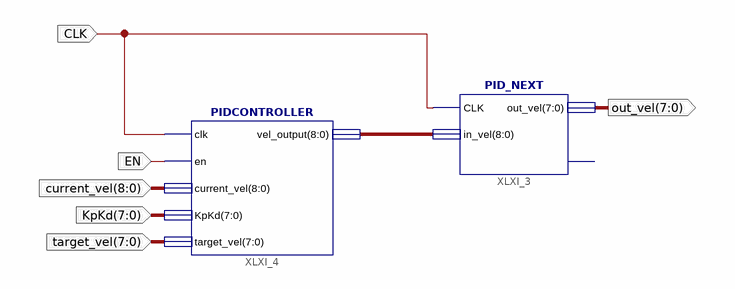
[diagram p0: schematic sheet 1]
// Xilinx ISE schematic sub_part.sch (spartan6) as structural Verilog: 2 symbols, 6 ports
module sub_part (
  input  CLK,
  input  EN,
  input  [8:0] current_vel,
  input  [7:0] KpKd,
  input  [7:0] target_vel,
  output [7:0] out_vel
);

  wire [8:0] XLXN_2;

  PID_NEXT XLXI_3 (.CLK(CLK), .in_vel(XLXN_2), .out_vel(out_vel));  // open: ovf
  PIDCONTROLLER XLXI_4 (
    .clk(CLK), .en(EN), .target_vel(target_vel), .current_vel(current_vel), .KpKd(KpKd), .vel_output(XLXN_2));
endmodule
